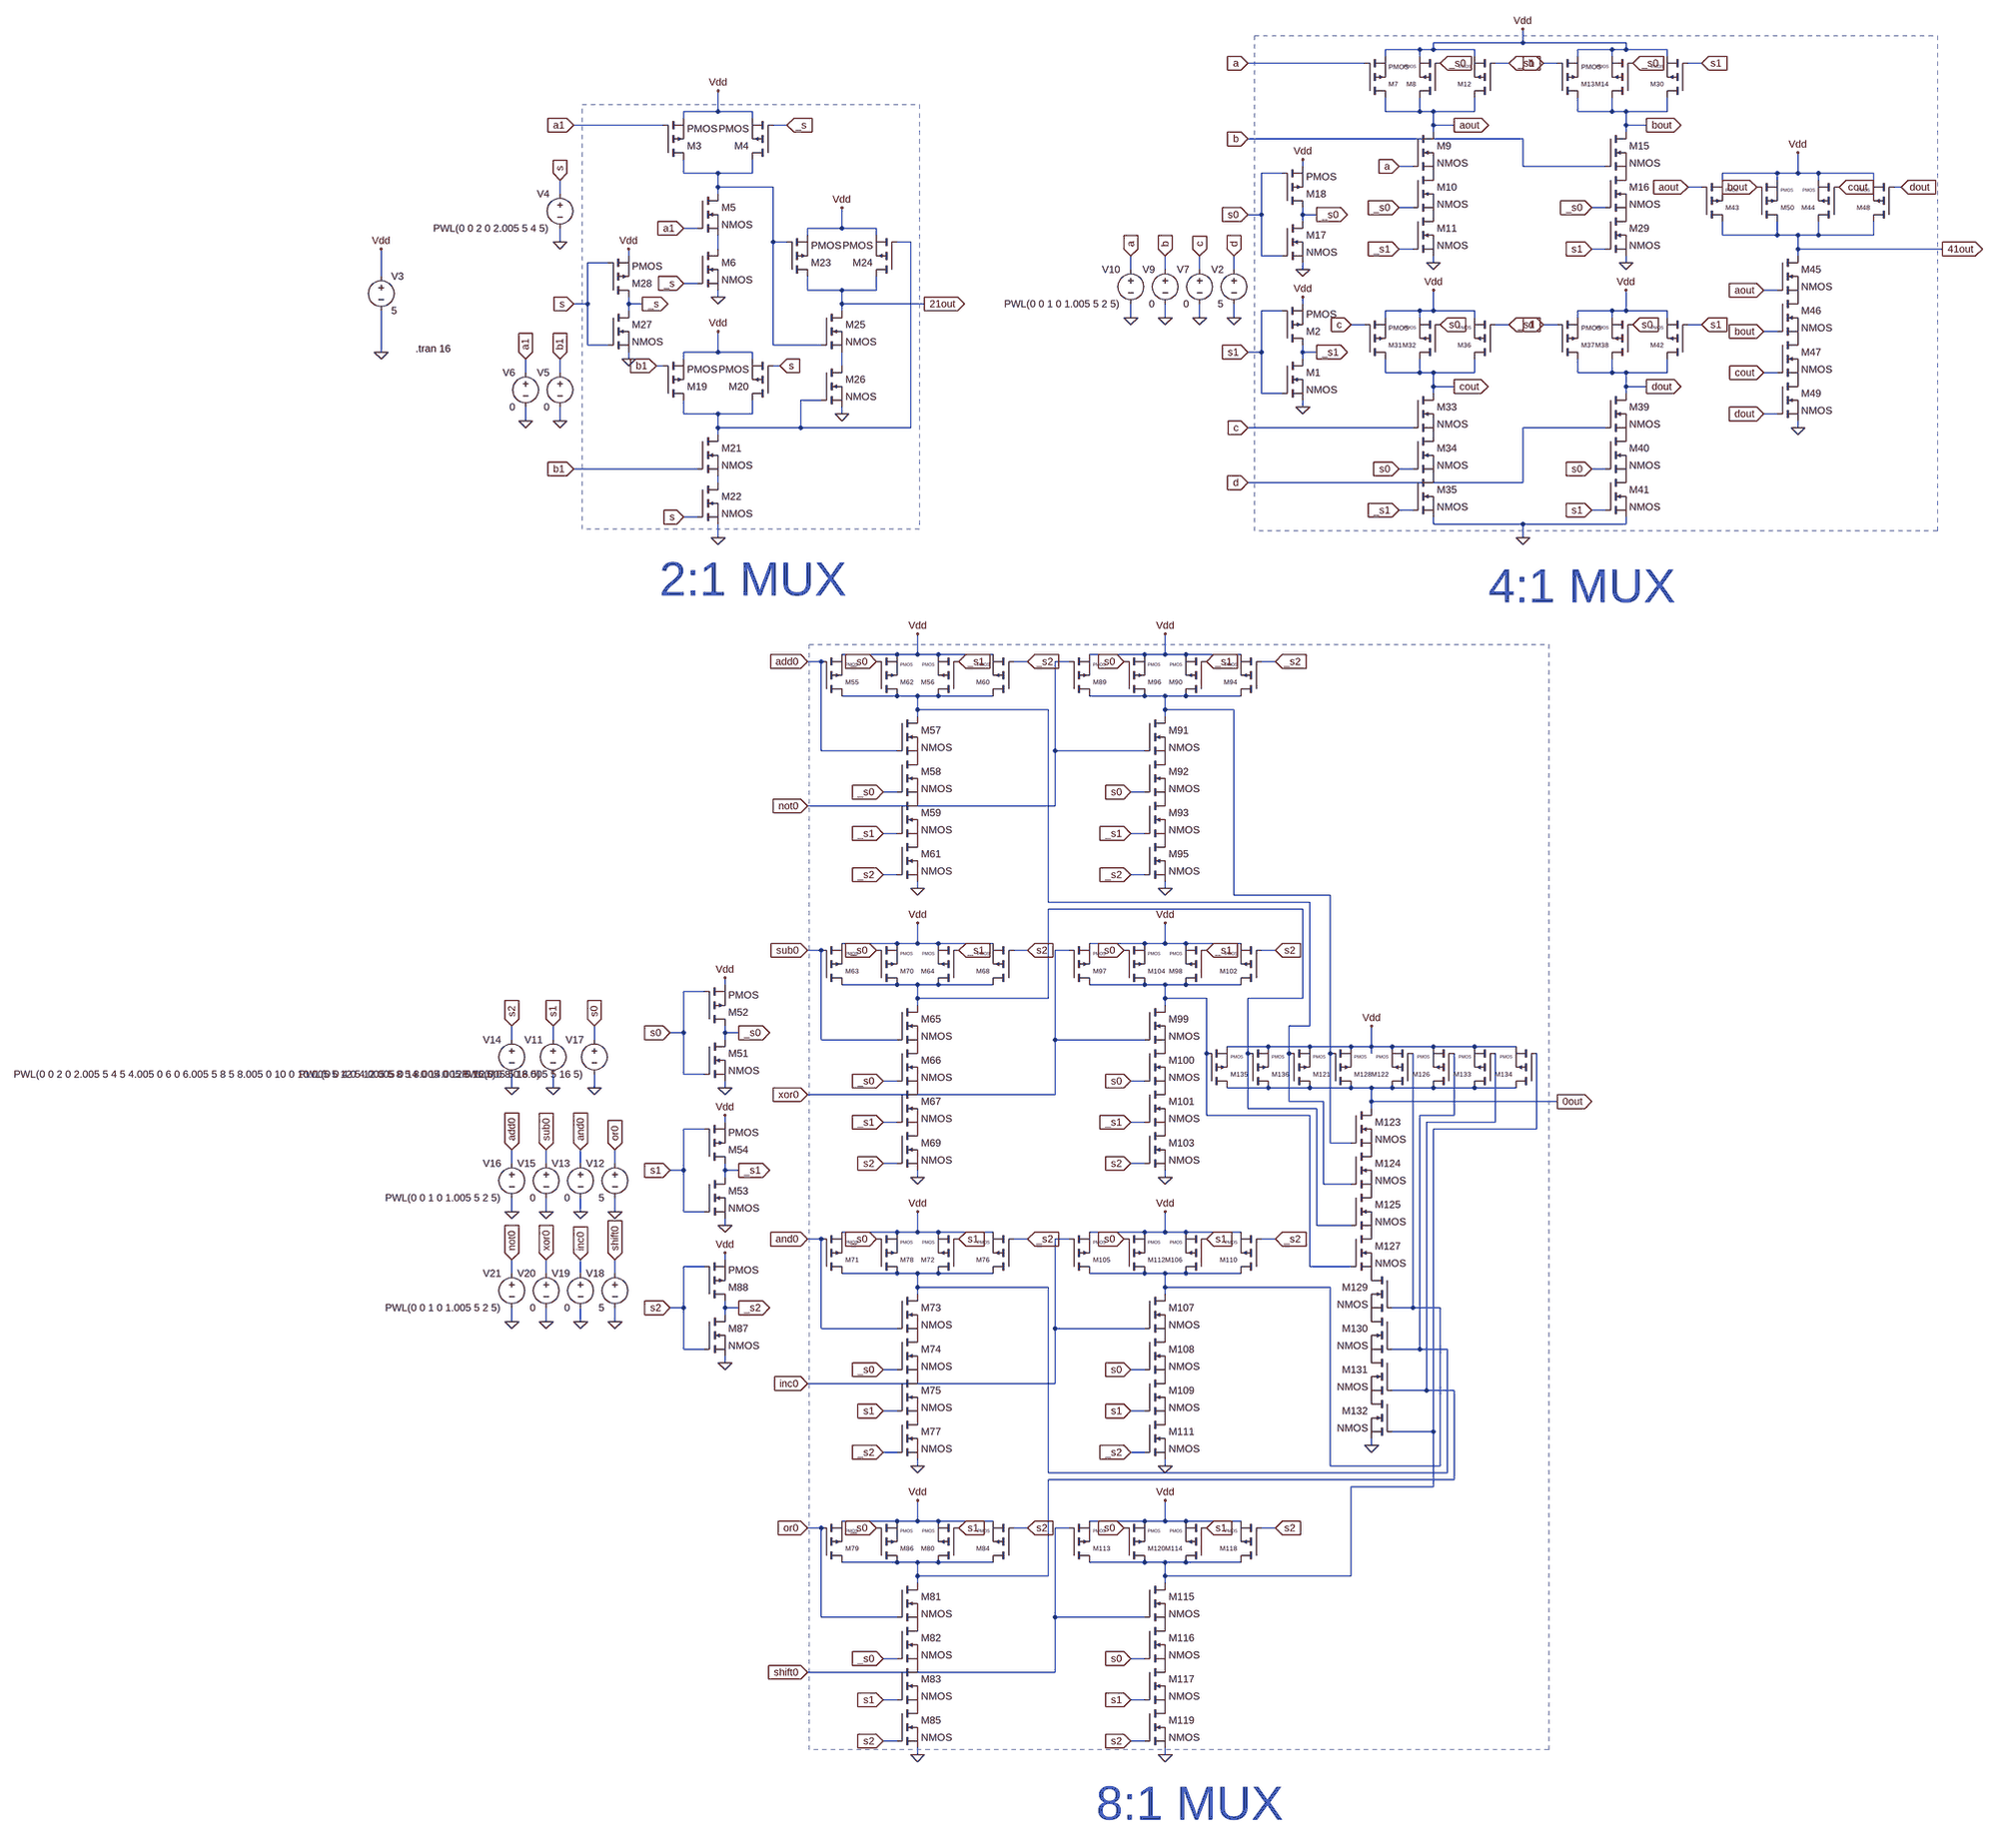
[diagram p0: schematic Digital MUX .asc]
Digital MUX .asc, the LTspice schematic file:
Version 4
SHEET 1 5552 4060
WIRE 1904 -736 1904 -768
WIRE 1904 -736 1696 -736
WIRE 2144 -736 1904 -736
WIRE 1664 -720 1584 -720
WIRE 1696 -720 1696 -736
WIRE 1696 -720 1664 -720
WIRE 1792 -720 1696 -720
WIRE 2112 -720 2032 -720
WIRE 2144 -720 2144 -736
WIRE 2144 -720 2112 -720
WIRE 2240 -720 2144 -720
WIRE 1584 -704 1584 -720
WIRE 1664 -704 1664 -720
WIRE 1792 -704 1792 -720
WIRE 2032 -704 2032 -720
WIRE 2112 -704 2112 -720
WIRE 2240 -704 2240 -720
WIRE 1536 -688 1264 -688
WIRE 1872 -688 1840 -688
WIRE 1984 -688 1952 -688
WIRE 2320 -688 2288 -688
WIRE 32 -576 32 -624
WIRE 32 -576 -48 -576
WIRE 112 -576 32 -576
WIRE 1584 -576 1584 -608
WIRE 1664 -576 1664 -608
WIRE 1664 -576 1584 -576
WIRE 1696 -576 1664 -576
WIRE 1792 -576 1792 -608
WIRE 1792 -576 1696 -576
WIRE 2032 -576 2032 -608
WIRE 2112 -576 2112 -608
WIRE 2112 -576 2032 -576
WIRE 2144 -576 2112 -576
WIRE 2240 -576 2240 -608
WIRE 2240 -576 2144 -576
WIRE -48 -560 -48 -576
WIRE 112 -560 112 -576
WIRE -96 -544 -304 -544
WIRE 192 -544 160 -544
WIRE 1696 -544 1696 -576
WIRE 1744 -544 1696 -544
WIRE 2144 -544 2144 -576
WIRE 2192 -544 2144 -544
WIRE 1696 -528 1696 -544
WIRE 2144 -528 2144 -544
WIRE 1904 -512 1264 -512
WIRE 1392 -448 1392 -464
WIRE 1648 -448 1616 -448
WIRE 1904 -448 1904 -512
WIRE 2096 -448 1904 -448
WIRE -48 -432 -48 -464
WIRE 32 -432 -48 -432
WIRE 112 -432 112 -464
WIRE 112 -432 32 -432
WIRE 1344 -432 1296 -432
WIRE 2496 -432 2368 -432
WIRE 2544 -432 2544 -480
WIRE 2544 -432 2496 -432
WIRE 2592 -432 2544 -432
WIRE 2720 -432 2592 -432
WIRE 2368 -416 2368 -432
WIRE 2496 -416 2496 -432
WIRE 2592 -416 2592 -432
WIRE 2720 -416 2720 -432
WIRE 32 -400 32 -432
WIRE 160 -400 32 -400
WIRE 2320 -400 2288 -400
WIRE 2784 -400 2768 -400
WIRE -336 -384 -336 -416
WIRE 32 -384 32 -400
WIRE 1648 -352 1616 -352
WIRE 2096 -352 2064 -352
WIRE 1296 -336 1296 -432
WIRE 1296 -336 1264 -336
WIRE 1392 -336 1392 -352
WIRE 1424 -336 1392 -336
WIRE 1392 -320 1392 -336
WIRE -16 -304 -48 -304
WIRE 320 -304 320 -352
WIRE 320 -304 240 -304
WIRE 400 -304 320 -304
WIRE 240 -288 240 -304
WIRE 400 -288 400 -304
WIRE 2368 -288 2368 -320
WIRE 2496 -288 2496 -320
WIRE 2496 -288 2368 -288
WIRE 2544 -288 2496 -288
WIRE 2592 -288 2592 -320
WIRE 2592 -288 2544 -288
WIRE 2720 -288 2720 -320
WIRE 2720 -288 2592 -288
WIRE -336 -272 -336 -304
WIRE 160 -272 160 -400
WIRE 192 -272 160 -272
WIRE 480 -272 448 -272
WIRE 32 -256 32 -288
WIRE 1648 -256 1616 -256
WIRE 2096 -256 2064 -256
WIRE 2544 -256 2544 -288
WIRE 2880 -256 2544 -256
WIRE -176 -240 -176 -256
WIRE 1296 -240 1296 -336
WIRE 1344 -240 1296 -240
WIRE 2544 -240 2544 -256
WIRE -224 -224 -272 -224
WIRE 1696 -224 1696 -240
WIRE 2144 -224 2144 -240
WIRE 992 -208 992 -240
WIRE 1072 -208 1072 -240
WIRE 1152 -208 1152 -240
WIRE 1232 -208 1232 -240
WIRE 1392 -208 1392 -224
WIRE -752 -192 -752 -256
WIRE -16 -176 -48 -176
WIRE 240 -160 240 -192
WIRE 320 -160 240 -160
WIRE 400 -160 400 -192
WIRE 400 -160 320 -160
WIRE 2496 -160 2464 -160
WIRE 32 -144 32 -160
WIRE -272 -128 -272 -224
WIRE -272 -128 -304 -128
WIRE -176 -128 -176 -144
WIRE -144 -128 -176 -128
WIRE 320 -128 320 -160
WIRE 512 -128 320 -128
WIRE 1392 -128 1392 -144
WIRE -176 -112 -176 -128
WIRE 320 -112 320 -128
WIRE 1344 -112 1296 -112
WIRE 1664 -112 1584 -112
WIRE 1696 -112 1696 -160
WIRE 1696 -112 1664 -112
WIRE 1792 -112 1696 -112
WIRE 2112 -112 2032 -112
WIRE 2144 -112 2144 -160
WIRE 2144 -112 2112 -112
WIRE 2240 -112 2144 -112
WIRE 992 -96 992 -128
WIRE 1072 -96 1072 -128
WIRE 1152 -96 1152 -128
WIRE 1232 -96 1232 -128
WIRE 1584 -96 1584 -112
WIRE 1664 -96 1664 -112
WIRE 1792 -96 1792 -112
WIRE 2032 -96 2032 -112
WIRE 2112 -96 2112 -112
WIRE 2240 -96 2240 -112
WIRE 1536 -80 1504 -80
WIRE 1872 -80 1840 -80
WIRE 1984 -80 1952 -80
WIRE 2320 -80 2288 -80
WIRE 2496 -64 2464 -64
WIRE -272 -32 -272 -128
WIRE -224 -32 -272 -32
WIRE 160 -32 160 -272
WIRE 272 -32 160 -32
WIRE -752 -16 -752 -112
WIRE 32 -16 32 -64
WIRE 32 -16 -48 -16
WIRE 112 -16 32 -16
WIRE 1296 -16 1296 -112
WIRE 1296 -16 1264 -16
WIRE 1392 -16 1392 -32
WIRE 1424 -16 1392 -16
WIRE -176 0 -176 -16
WIRE -48 0 -48 -16
WIRE 112 0 112 -16
WIRE 1392 0 1392 -16
WIRE -96 16 -112 16
WIRE 176 16 160 16
WIRE 320 16 320 -16
WIRE -416 32 -416 0
WIRE -336 32 -336 0
WIRE 1584 32 1584 0
WIRE 1664 32 1664 0
WIRE 1664 32 1584 32
WIRE 1696 32 1664 32
WIRE 1792 32 1792 0
WIRE 1792 32 1696 32
WIRE 2032 32 2032 0
WIRE 2112 32 2112 0
WIRE 2112 32 2032 32
WIRE 2144 32 2112 32
WIRE 2240 32 2240 0
WIRE 2240 32 2144 32
WIRE 2496 32 2464 32
WIRE 1696 64 1696 32
WIRE 1744 64 1696 64
WIRE 2144 64 2144 32
WIRE 2192 64 2144 64
WIRE 1296 80 1296 -16
WIRE 1344 80 1296 80
WIRE 1696 80 1696 64
WIRE 2144 80 2144 64
WIRE 272 96 224 96
WIRE 1392 112 1392 96
WIRE -48 128 -48 96
WIRE 32 128 -48 128
WIRE 112 128 112 96
WIRE 112 128 32 128
WIRE 320 128 320 112
WIRE 2496 128 2464 128
WIRE -416 144 -416 112
WIRE -336 144 -336 112
WIRE 32 160 32 128
WIRE 224 160 224 96
WIRE 224 160 32 160
WIRE 480 160 480 -272
WIRE 480 160 224 160
WIRE 1648 160 1264 160
WIRE 2096 160 1904 160
WIRE 2544 160 2544 144
WIRE 32 176 32 160
WIRE -16 256 -304 256
WIRE 1648 256 1616 256
WIRE 2096 256 2064 256
WIRE 32 288 32 272
WIRE 1904 288 1904 160
WIRE 1904 288 1264 288
WIRE 1648 352 1616 352
WIRE 2096 352 2064 352
WIRE -16 368 -48 368
WIRE 1696 384 1696 368
WIRE 1904 384 1696 384
WIRE 2144 384 2144 368
WIRE 2144 384 1904 384
WIRE 32 416 32 384
WIRE 1904 416 1904 384
WIRE 448 688 320 688
WIRE 496 688 496 640
WIRE 496 688 448 688
WIRE 544 688 496 688
WIRE 672 688 544 688
WIRE 1024 688 896 688
WIRE 1072 688 1072 640
WIRE 1072 688 1024 688
WIRE 1120 688 1072 688
WIRE 1248 688 1120 688
WIRE 272 704 240 704
WIRE 752 704 720 704
WIRE 848 704 816 704
WIRE 1328 704 1296 704
WIRE 448 784 320 784
WIRE 496 784 448 784
WIRE 544 784 496 784
WIRE 672 784 544 784
WIRE 1024 784 896 784
WIRE 1072 784 1024 784
WIRE 1120 784 1072 784
WIRE 1248 784 1120 784
WIRE 496 816 496 784
WIRE 800 816 496 816
WIRE 1072 816 1072 784
WIRE 1232 816 1072 816
WIRE 496 832 496 816
WIRE 1072 832 1072 816
WIRE 272 912 272 704
WIRE 448 912 272 912
WIRE 816 912 816 704
WIRE 1024 912 816 912
WIRE 448 1008 416 1008
WIRE 1024 1008 992 1008
WIRE 816 1040 816 912
WIRE 816 1040 240 1040
WIRE 448 1104 416 1104
WIRE 1024 1104 992 1104
WIRE 448 1200 416 1200
WIRE 1024 1200 992 1200
WIRE 496 1232 496 1216
WIRE 1072 1232 1072 1216
WIRE 1232 1248 1232 816
WIRE 1456 1248 1232 1248
WIRE 800 1264 800 816
WIRE 1408 1264 800 1264
WIRE 1392 1280 800 1280
WIRE 448 1360 320 1360
WIRE 496 1360 496 1312
WIRE 496 1360 448 1360
WIRE 544 1360 496 1360
WIRE 672 1360 544 1360
WIRE 1024 1360 896 1360
WIRE 1072 1360 1072 1312
WIRE 1072 1360 1024 1360
WIRE 1120 1360 1072 1360
WIRE 1248 1360 1120 1360
WIRE 272 1376 240 1376
WIRE 752 1376 720 1376
WIRE 848 1376 816 1376
WIRE 1328 1376 1296 1376
WIRE 48 1456 48 1440
WIRE 448 1456 320 1456
WIRE 496 1456 448 1456
WIRE 544 1456 496 1456
WIRE 672 1456 544 1456
WIRE 1024 1456 896 1456
WIRE 1072 1456 1024 1456
WIRE 1120 1456 1072 1456
WIRE 1248 1456 1120 1456
WIRE 0 1472 -48 1472
WIRE 496 1488 496 1456
WIRE 800 1488 800 1280
WIRE 800 1488 496 1488
WIRE 1072 1488 1072 1456
WIRE 1168 1488 1072 1488
WIRE 1392 1488 1392 1280
WIRE 1392 1488 1264 1488
WIRE 496 1504 496 1488
WIRE 1072 1504 1072 1488
WIRE 1408 1552 1408 1264
WIRE 1408 1552 1360 1552
WIRE -48 1568 -48 1472
WIRE -48 1568 -80 1568
WIRE 48 1568 48 1552
WIRE 80 1568 48 1568
WIRE -448 1584 -448 1552
WIRE -352 1584 -352 1552
WIRE -256 1584 -256 1552
WIRE 48 1584 48 1568
WIRE 272 1584 272 1376
WIRE 448 1584 272 1584
WIRE 816 1584 816 1376
WIRE 1024 1584 816 1584
WIRE 1312 1600 1216 1600
WIRE 1408 1600 1312 1600
WIRE 1504 1600 1408 1600
WIRE 1552 1600 1552 1552
WIRE 1552 1600 1504 1600
WIRE 1600 1600 1552 1600
WIRE 1696 1600 1600 1600
WIRE 1792 1600 1696 1600
WIRE 1888 1600 1792 1600
WIRE 1168 1616 1168 1488
WIRE 1264 1616 1264 1488
WIRE 1360 1616 1360 1552
WIRE 1456 1616 1456 1248
WIRE 1552 1616 1552 1600
WIRE -48 1664 -48 1568
WIRE 0 1664 -48 1664
WIRE 448 1680 416 1680
WIRE 1024 1680 992 1680
WIRE -448 1696 -448 1664
WIRE -352 1696 -352 1664
WIRE -256 1696 -256 1664
WIRE 48 1696 48 1680
WIRE 1312 1696 1216 1696
WIRE 1408 1696 1312 1696
WIRE 1504 1696 1408 1696
WIRE 1552 1696 1504 1696
WIRE 1600 1696 1552 1696
WIRE 1696 1696 1600 1696
WIRE 1792 1696 1696 1696
WIRE 1888 1696 1792 1696
WIRE 816 1712 816 1584
WIRE 816 1712 240 1712
WIRE 1360 1728 1360 1616
WIRE 1440 1728 1360 1728
WIRE 1552 1728 1552 1696
WIRE 1984 1728 1552 1728
WIRE 1264 1744 1264 1616
WIRE 1424 1744 1264 1744
WIRE 1552 1744 1552 1728
WIRE 1168 1760 1168 1616
WIRE 1408 1760 1168 1760
WIRE 1744 1760 1744 1616
WIRE 1744 1760 1664 1760
WIRE 48 1776 48 1760
WIRE 448 1776 416 1776
WIRE 1024 1776 992 1776
WIRE 1840 1776 1840 1616
WIRE 1840 1776 1680 1776
WIRE 0 1792 -48 1792
WIRE 1936 1792 1936 1616
WIRE 1936 1792 1696 1792
WIRE 1456 1824 1456 1616
WIRE 1504 1824 1456 1824
WIRE -448 1872 -448 1840
WIRE -368 1872 -368 1840
WIRE -288 1872 -288 1840
WIRE -208 1872 -208 1840
WIRE 448 1872 416 1872
WIRE 1024 1872 992 1872
WIRE -48 1888 -48 1792
WIRE -48 1888 -80 1888
WIRE 48 1888 48 1872
WIRE 80 1888 48 1888
WIRE 48 1904 48 1888
WIRE 496 1904 496 1888
WIRE 1072 1904 1072 1888
WIRE 1440 1920 1440 1728
WIRE 1504 1920 1440 1920
WIRE -448 1984 -448 1952
WIRE -368 1984 -368 1952
WIRE -288 1984 -288 1952
WIRE -208 1984 -208 1952
WIRE -48 1984 -48 1888
WIRE 0 1984 -48 1984
WIRE 48 2016 48 2000
WIRE 1424 2016 1424 1744
WIRE 1504 2016 1424 2016
WIRE 448 2032 320 2032
WIRE 496 2032 496 1984
WIRE 496 2032 448 2032
WIRE 544 2032 496 2032
WIRE 672 2032 544 2032
WIRE 1024 2032 896 2032
WIRE 1072 2032 1072 1984
WIRE 1072 2032 1024 2032
WIRE 1120 2032 1072 2032
WIRE 1248 2032 1120 2032
WIRE 272 2048 240 2048
WIRE 752 2048 720 2048
WIRE 848 2048 816 2048
WIRE 1328 2048 1296 2048
WIRE 48 2096 48 2080
WIRE 0 2112 -48 2112
WIRE 1408 2112 1408 1760
WIRE 1504 2112 1408 2112
WIRE -448 2128 -448 2096
WIRE -368 2128 -368 2096
WIRE -288 2128 -288 2096
WIRE -208 2128 -208 2096
WIRE 448 2128 320 2128
WIRE 496 2128 448 2128
WIRE 544 2128 496 2128
WIRE 672 2128 544 2128
WIRE 1024 2128 896 2128
WIRE 1072 2128 1024 2128
WIRE 1120 2128 1072 2128
WIRE 1248 2128 1120 2128
WIRE 496 2160 496 2128
WIRE 800 2160 496 2160
WIRE 1072 2160 1072 2128
WIRE 1456 2160 1072 2160
WIRE 496 2176 496 2160
WIRE 1072 2176 1072 2160
WIRE -48 2208 -48 2112
WIRE -48 2208 -80 2208
WIRE 48 2208 48 2192
WIRE 80 2208 48 2208
WIRE 1648 2208 1648 1616
WIRE 1648 2208 1600 2208
WIRE 1712 2208 1648 2208
WIRE 48 2224 48 2208
WIRE -448 2240 -448 2208
WIRE -368 2240 -368 2208
WIRE -288 2240 -288 2208
WIRE -208 2240 -208 2208
WIRE 272 2256 272 2048
WIRE 448 2256 272 2256
WIRE 816 2256 816 2048
WIRE 1024 2256 816 2256
WIRE -48 2304 -48 2208
WIRE 0 2304 -48 2304
WIRE 1664 2304 1664 1760
WIRE 1664 2304 1600 2304
WIRE 1728 2304 1664 2304
WIRE 48 2336 48 2320
WIRE 448 2352 416 2352
WIRE 1024 2352 992 2352
WIRE 816 2384 816 2256
WIRE 816 2384 240 2384
WIRE 1680 2400 1680 1776
WIRE 1680 2400 1600 2400
WIRE 1744 2400 1680 2400
WIRE 448 2448 416 2448
WIRE 1024 2448 992 2448
WIRE 1696 2496 1696 1792
WIRE 1696 2496 1600 2496
WIRE 1552 2528 1552 2512
WIRE 448 2544 416 2544
WIRE 1024 2544 992 2544
WIRE 496 2576 496 2560
WIRE 1072 2576 1072 2560
WIRE 1456 2576 1456 2160
WIRE 1712 2576 1712 2208
WIRE 1712 2576 1456 2576
WIRE 800 2592 800 2160
WIRE 1728 2592 1728 2304
WIRE 1728 2592 800 2592
WIRE 1744 2608 1744 2400
WIRE 1744 2608 800 2608
WIRE 1696 2624 1696 2496
WIRE 1696 2624 1504 2624
WIRE 448 2704 320 2704
WIRE 496 2704 496 2656
WIRE 496 2704 448 2704
WIRE 544 2704 496 2704
WIRE 672 2704 544 2704
WIRE 1024 2704 896 2704
WIRE 1072 2704 1072 2656
WIRE 1072 2704 1024 2704
WIRE 1120 2704 1072 2704
WIRE 1248 2704 1120 2704
WIRE 272 2720 240 2720
WIRE 752 2720 720 2720
WIRE 848 2720 816 2720
WIRE 1328 2720 1296 2720
WIRE 448 2800 320 2800
WIRE 496 2800 448 2800
WIRE 544 2800 496 2800
WIRE 672 2800 544 2800
WIRE 1024 2800 896 2800
WIRE 1072 2800 1024 2800
WIRE 1120 2800 1072 2800
WIRE 1248 2800 1120 2800
WIRE 496 2832 496 2800
WIRE 800 2832 800 2608
WIRE 800 2832 496 2832
WIRE 1072 2832 1072 2800
WIRE 1504 2832 1504 2624
WIRE 1504 2832 1072 2832
WIRE 496 2848 496 2832
WIRE 1072 2848 1072 2832
WIRE 272 2928 272 2720
WIRE 448 2928 272 2928
WIRE 816 2928 816 2720
WIRE 1024 2928 816 2928
WIRE 448 3024 416 3024
WIRE 1024 3024 992 3024
WIRE 816 3056 816 2928
WIRE 816 3056 240 3056
WIRE 448 3120 416 3120
WIRE 1024 3120 992 3120
WIRE 448 3216 416 3216
WIRE 1024 3216 992 3216
WIRE 496 3248 496 3232
WIRE 1072 3248 1072 3232
FLAG -752 -16 0
FLAG -752 -256 Vdd
FLAG -336 -272 0
FLAG -336 -416 s
IOPIN -336 -416 In
FLAG -336 144 0
FLAG -336 0 b1
IOPIN -336 0 In
FLAG -416 144 0
FLAG -416 0 a1
IOPIN -416 0 In
FLAG 32 -624 Vdd
FLAG 32 -144 0
FLAG -48 -176 _s
IOPIN -48 -176 In
FLAG -48 -304 a1
IOPIN -48 -304 In
FLAG -304 -544 a1
IOPIN -304 -544 In
FLAG 192 -544 _s
IOPIN 192 -544 In
FLAG 32 -64 Vdd
FLAG 32 416 0
FLAG -48 368 s
IOPIN -48 368 In
FLAG -304 256 b1
IOPIN -304 256 In
FLAG -112 16 b1
IOPIN -112 16 In
FLAG 176 16 s
IOPIN 176 16 In
FLAG 320 -352 Vdd
FLAG 320 128 0
FLAG 512 -128 21out
IOPIN 512 -128 Out
FLAG -176 0 0
FLAG -176 -256 Vdd
FLAG -144 -128 _s
IOPIN -144 -128 Out
FLAG -304 -128 s
IOPIN -304 -128 In
FLAG 1232 -96 0
FLAG 1232 -240 d
IOPIN 1232 -240 In
FLAG 1152 -96 0
FLAG 1152 -240 c
IOPIN 1152 -240 In
FLAG 1392 -208 0
FLAG 1392 -464 Vdd
FLAG 1424 -336 _s0
IOPIN 1424 -336 Out
FLAG 1264 -336 s0
IOPIN 1264 -336 In
FLAG 1392 112 0
FLAG 1392 -144 Vdd
FLAG 1424 -16 _s1
IOPIN 1424 -16 Out
FLAG 1264 -16 s1
IOPIN 1264 -16 In
FLAG 1904 -768 Vdd
FLAG 1264 -688 a
IOPIN 1264 -688 In
FLAG 1712 -688 _s0
IOPIN 1712 -688 In
FLAG 1744 -544 aout
IOPIN 1744 -544 Out
FLAG 1616 -352 _s0
IOPIN 1616 -352 In
FLAG 1616 -448 a
IOPIN 1616 -448 In
FLAG 1696 -224 0
FLAG 1616 -256 _s1
IOPIN 1616 -256 In
FLAG 1872 -688 _s1
IOPIN 1872 -688 In
FLAG 1952 -688 b
IOPIN 1952 -688 In
FLAG 2160 -688 _s0
IOPIN 2160 -688 In
FLAG 2192 -544 bout
IOPIN 2192 -544 Out
FLAG 2064 -352 _s0
IOPIN 2064 -352 In
FLAG 1264 -512 b
IOPIN 1264 -512 In
FLAG 2144 -224 0
FLAG 2064 -256 s1
IOPIN 2064 -256 In
FLAG 2320 -688 s1
IOPIN 2320 -688 In
FLAG 1696 -160 Vdd
FLAG 1504 -80 c
IOPIN 1504 -80 In
FLAG 1712 -80 s0
IOPIN 1712 -80 In
FLAG 1744 64 cout
IOPIN 1744 64 Out
FLAG 1616 256 s0
IOPIN 1616 256 In
FLAG 1264 160 c
IOPIN 1264 160 In
FLAG 1904 416 0
FLAG 1616 352 _s1
IOPIN 1616 352 In
FLAG 1872 -80 _s1
IOPIN 1872 -80 In
FLAG 2144 -160 Vdd
FLAG 1952 -80 d
IOPIN 1952 -80 In
FLAG 2160 -80 s0
IOPIN 2160 -80 In
FLAG 2192 64 dout
IOPIN 2192 64 Out
FLAG 2064 256 s0
IOPIN 2064 256 In
FLAG 1264 288 d
IOPIN 1264 288 In
FLAG 2064 352 s1
IOPIN 2064 352 In
FLAG 2320 -80 s1
IOPIN 2320 -80 In
FLAG 1072 -96 0
FLAG 1072 -240 b
IOPIN 1072 -240 In
FLAG 992 -96 0
FLAG 992 -240 a
IOPIN 992 -240 In
FLAG 2544 -480 Vdd
FLAG 2288 -400 aout
IOPIN 2288 -400 In
FLAG 2640 -400 cout
IOPIN 2640 -400 In
FLAG 2880 -256 41out
IOPIN 2880 -256 Out
FLAG 2464 -64 bout
IOPIN 2464 -64 In
FLAG 2464 -160 aout
IOPIN 2464 -160 In
FLAG 2464 32 cout
IOPIN 2464 32 In
FLAG 2784 -400 dout
IOPIN 2784 -400 In
FLAG 2544 160 0
FLAG 2464 128 dout
IOPIN 2464 128 In
FLAG 2448 -400 bout
IOPIN 2448 -400 In
FLAG -352 1696 0
FLAG -352 1552 s1
IOPIN -352 1552 In
FLAG -208 1984 0
FLAG -208 1840 or0
IOPIN -208 1840 In
FLAG -288 1984 0
FLAG -288 1840 and0
IOPIN -288 1840 In
FLAG 48 1696 0
FLAG 48 1440 Vdd
FLAG 80 1568 _s0
IOPIN 80 1568 Out
FLAG -80 1568 s0
IOPIN -80 1568 In
FLAG -448 1696 0
FLAG -448 1552 s2
IOPIN -448 1552 In
FLAG 48 2016 0
FLAG 48 1760 Vdd
FLAG 80 1888 _s1
IOPIN 80 1888 Out
FLAG -80 1888 s1
IOPIN -80 1888 In
FLAG -368 1984 0
FLAG -368 1840 sub0
IOPIN -368 1840 In
FLAG -448 1984 0
FLAG -448 1840 add0
IOPIN -448 1840 In
FLAG -256 1696 0
FLAG -256 1552 s0
IOPIN -256 1552 In
FLAG -208 2240 0
FLAG -208 2096 shift0
IOPIN -208 2096 In
FLAG -288 2240 0
FLAG -288 2096 inc0
IOPIN -288 2096 In
FLAG -368 2240 0
FLAG -368 2096 xor0
IOPIN -368 2096 In
FLAG -448 2240 0
FLAG -448 2096 not0
IOPIN -448 2096 In
FLAG 48 2336 0
FLAG 48 2080 Vdd
FLAG 80 2208 _s2
IOPIN 80 2208 Out
FLAG -80 2208 s2
IOPIN -80 2208 In
FLAG 496 640 Vdd
FLAG 240 704 add0
IOPIN 240 704 In
FLAG 592 704 _s1
IOPIN 592 704 In
FLAG 416 1008 _s0
IOPIN 416 1008 In
FLAG 416 1104 _s1
IOPIN 416 1104 In
FLAG 752 704 _s2
IOPIN 752 704 In
FLAG 496 1232 0
FLAG 416 1200 _s2
IOPIN 416 1200 In
FLAG 400 704 _s0
IOPIN 400 704 In
FLAG 496 1312 Vdd
FLAG 240 1376 sub0
IOPIN 240 1376 In
FLAG 592 1376 _s1
IOPIN 592 1376 In
FLAG 416 1680 _s0
IOPIN 416 1680 In
FLAG 416 1776 _s1
IOPIN 416 1776 In
FLAG 752 1376 s2
IOPIN 752 1376 In
FLAG 496 1904 0
FLAG 416 1872 s2
IOPIN 416 1872 In
FLAG 400 1376 _s0
IOPIN 400 1376 In
FLAG 496 1984 Vdd
FLAG 240 2048 and0
IOPIN 240 2048 In
FLAG 592 2048 s1
IOPIN 592 2048 In
FLAG 416 2352 _s0
IOPIN 416 2352 In
FLAG 416 2448 s1
IOPIN 416 2448 In
FLAG 752 2048 _s2
IOPIN 752 2048 In
FLAG 496 2576 0
FLAG 416 2544 _s2
IOPIN 416 2544 In
FLAG 400 2048 _s0
IOPIN 400 2048 In
FLAG 496 2656 Vdd
FLAG 240 2720 or0
IOPIN 240 2720 In
FLAG 592 2720 s1
IOPIN 592 2720 In
FLAG 416 3024 _s0
IOPIN 416 3024 In
FLAG 416 3120 s1
IOPIN 416 3120 In
FLAG 752 2720 s2
IOPIN 752 2720 In
FLAG 496 3248 0
FLAG 416 3216 s2
IOPIN 416 3216 In
FLAG 400 2720 _s0
IOPIN 400 2720 In
FLAG 1072 640 Vdd
FLAG 240 1040 not0
IOPIN 240 1040 In
FLAG 1168 704 _s1
IOPIN 1168 704 In
FLAG 992 1008 s0
IOPIN 992 1008 In
FLAG 992 1104 _s1
IOPIN 992 1104 In
FLAG 1328 704 _s2
IOPIN 1328 704 In
FLAG 1072 1232 0
FLAG 992 1200 _s2
IOPIN 992 1200 In
FLAG 976 704 s0
IOPIN 976 704 In
FLAG 1072 1312 Vdd
FLAG 240 1712 xor0
IOPIN 240 1712 In
FLAG 1168 1376 _s1
IOPIN 1168 1376 In
FLAG 992 1680 s0
IOPIN 992 1680 In
FLAG 992 1776 _s1
IOPIN 992 1776 In
FLAG 1328 1376 s2
IOPIN 1328 1376 In
FLAG 1072 1904 0
FLAG 992 1872 s2
IOPIN 992 1872 In
FLAG 976 1376 s0
IOPIN 976 1376 In
FLAG 1072 1984 Vdd
FLAG 240 2384 inc0
IOPIN 240 2384 In
FLAG 1168 2048 s1
IOPIN 1168 2048 In
FLAG 992 2352 s0
IOPIN 992 2352 In
FLAG 992 2448 s1
IOPIN 992 2448 In
FLAG 1328 2048 _s2
IOPIN 1328 2048 In
FLAG 1072 2576 0
FLAG 992 2544 _s2
IOPIN 992 2544 In
FLAG 976 2048 s0
IOPIN 976 2048 In
FLAG 1072 2656 Vdd
FLAG 240 3056 shift0
IOPIN 240 3056 In
FLAG 1168 2720 s1
IOPIN 1168 2720 In
FLAG 992 3024 s0
IOPIN 992 3024 In
FLAG 992 3120 s1
IOPIN 992 3120 In
FLAG 1328 2720 s2
IOPIN 1328 2720 In
FLAG 1072 3248 0
FLAG 992 3216 s2
IOPIN 992 3216 In
FLAG 976 2720 s0
IOPIN 976 2720 In
FLAG 1552 1552 Vdd
FLAG 1984 1728 0out
IOPIN 1984 1728 Out
FLAG 1552 2528 0
SYMBOL voltage -752 -208 R0
SYMATTR InstName V3
SYMATTR Value 5
SYMBOL voltage -336 -400 M0
SYMATTR InstName V4
SYMATTR Value PWL(0 0 2 0 2.005 5 4 5)
SYMBOL voltage -336 16 M0
SYMATTR InstName V5
SYMATTR Value 0
SYMBOL voltage -416 16 M0
SYMATTR InstName V6
SYMATTR Value 0
SYMBOL pmos -96 -464 M180
SYMATTR InstName M3
SYMBOL pmos 160 -464 R180
SYMATTR InstName M4
SYMBOL nmos -16 -384 R0
SYMATTR InstName M5
SYMBOL nmos -16 -256 R0
SYMATTR InstName M6
SYMBOL pmos -96 96 M180
SYMATTR InstName M19
SYMBOL pmos 160 96 R180
SYMATTR InstName M20
SYMBOL nmos -16 176 R0
SYMATTR InstName M21
SYMBOL nmos -16 288 R0
SYMATTR InstName M22
SYMBOL pmos 192 -192 M180
SYMATTR InstName M23
SYMBOL pmos 448 -192 R180
SYMATTR InstName M24
SYMBOL nmos 272 -112 R0
SYMATTR InstName M25
SYMBOL nmos 272 16 R0
SYMATTR InstName M26
SYMBOL nmos -224 -112 R0
SYMATTR InstName M27
SYMBOL pmos -224 -144 M180
SYMATTR InstName M28
SYMBOL voltage 1232 -224 M0
SYMATTR InstName V2
SYMATTR Value 5
SYMBOL voltage 1152 -224 M0
SYMATTR InstName V7
SYMATTR Value 0
SYMBOL nmos 1344 -320 R0
SYMATTR InstName M17
SYMBOL pmos 1344 -352 M180
SYMATTR InstName M18
SYMBOL nmos 1344 0 R0
SYMATTR InstName M1
SYMBOL pmos 1344 -32 M180
SYMATTR InstName M2
SYMBOL pmos 1536 -608 M180
WINDOW 0 56 32 Left 1
WINDOW 3 56 72 Left 1
SYMATTR InstName M7
SYMBOL pmos 1712 -608 R180
WINDOW 0 56 32 Left 1
WINDOW 3 56 72 Left 0
SYMATTR InstName M8
SYMBOL nmos 1648 -528 R0
SYMATTR InstName M9
SYMBOL nmos 1648 -432 R0
SYMATTR InstName M10
SYMBOL nmos 1648 -336 R0
SYMATTR InstName M11
SYMBOL pmos 1840 -608 R180
WINDOW 0 56 32 Left 1
WINDOW 3 56 72 Left 0
SYMATTR InstName M12
SYMBOL pmos 1984 -608 M180
WINDOW 0 56 32 Left 1
WINDOW 3 56 72 Left 1
SYMATTR InstName M13
SYMBOL pmos 2160 -608 R180
WINDOW 0 56 32 Left 1
WINDOW 3 56 72 Left 0
SYMATTR InstName M14
SYMBOL nmos 2096 -528 R0
SYMATTR InstName M15
SYMBOL nmos 2096 -432 R0
SYMATTR InstName M16
SYMBOL nmos 2096 -336 R0
SYMATTR InstName M29
SYMBOL pmos 2288 -608 R180
WINDOW 0 56 32 Left 1
WINDOW 3 56 72 Left 0
SYMATTR InstName M30
SYMBOL pmos 1536 0 M180
WINDOW 0 56 32 Left 1
WINDOW 3 56 72 Left 1
SYMATTR InstName M31
SYMBOL pmos 1712 0 R180
WINDOW 0 56 32 Left 1
WINDOW 3 56 72 Left 0
SYMATTR InstName M32
SYMBOL nmos 1648 80 R0
SYMATTR InstName M33
SYMBOL nmos 1648 176 R0
SYMATTR InstName M34
SYMBOL nmos 1648 272 R0
SYMATTR InstName M35
SYMBOL pmos 1840 0 R180
WINDOW 0 56 32 Left 1
WINDOW 3 56 72 Left 0
SYMATTR InstName M36
SYMBOL pmos 1984 0 M180
WINDOW 0 56 32 Left 1
WINDOW 3 56 72 Left 1
SYMATTR InstName M37
SYMBOL pmos 2160 0 R180
WINDOW 0 56 32 Left 1
WINDOW 3 56 72 Left 0
SYMATTR InstName M38
SYMBOL nmos 2096 80 R0
SYMATTR InstName M39
SYMBOL nmos 2096 176 R0
SYMATTR InstName M40
SYMBOL nmos 2096 272 R0
SYMATTR InstName M41
SYMBOL pmos 2288 0 R180
WINDOW 0 56 32 Left 1
WINDOW 3 56 72 Left 0
SYMATTR InstName M42
SYMBOL voltage 1072 -224 M0
SYMATTR InstName V9
SYMATTR Value 0
SYMBOL voltage 992 -224 M0
SYMATTR InstName V10
SYMATTR Value PWL(0 0 1 0 1.005 5 2 5)
SYMBOL pmos 2320 -320 M180
WINDOW 0 56 32 Left 1
WINDOW 3 56 72 Left 0
SYMATTR InstName M43
SYMBOL pmos 2640 -320 R180
WINDOW 0 56 32 Left 1
WINDOW 3 56 72 Left 0
SYMATTR InstName M44
SYMBOL nmos 2496 -240 R0
SYMATTR InstName M45
SYMBOL nmos 2496 -144 R0
SYMATTR InstName M46
SYMBOL nmos 2496 -48 R0
SYMATTR InstName M47
SYMBOL pmos 2768 -320 R180
WINDOW 0 56 32 Left 1
WINDOW 3 56 72 Left 0
SYMATTR InstName M48
SYMBOL nmos 2496 48 R0
SYMATTR InstName M49
SYMBOL pmos 2448 -320 M180
WINDOW 0 56 32 Left 1
WINDOW 3 56 72 Left 0
SYMATTR InstName M50
SYMBOL voltage -352 1568 M0
SYMATTR InstName V11
SYMATTR Value PWL(0 0 4 0 4.005 5 8 5 8.005 0 12 0 12.005 5 16 5)
SYMBOL voltage -208 1856 M0
SYMATTR InstName V12
SYMATTR Value 5
SYMBOL voltage -288 1856 M0
SYMATTR InstName V13
SYMATTR Value 0
SYMBOL nmos 0 1584 R0
SYMATTR InstName M51
SYMBOL pmos 0 1552 M180
SYMATTR InstName M52
SYMBOL voltage -448 1568 M0
SYMATTR InstName V14
SYMATTR Value PWL(0 0 2 0 2.005 5 4 5 4.005 0 6 0 6.005 5 8 5 8.005 0 10 0 10.005 5 12 5 12.005 0 14 0 14.005 5 16 5)
SYMBOL nmos 0 1904 R0
SYMATTR InstName M53
SYMBOL pmos 0 1872 M180
SYMATTR InstName M54
SYMBOL voltage -368 1856 M0
SYMATTR InstName V15
SYMATTR Value 0
SYMBOL voltage -448 1856 M0
SYMATTR InstName V16
SYMATTR Value PWL(0 0 1 0 1.005 5 2 5)
SYMBOL voltage -256 1568 M0
SYMATTR InstName V17
SYMATTR Value PWL(0 0 8 0 8.005 5 16 5)
SYMBOL voltage -208 2112 M0
SYMATTR InstName V18
SYMATTR Value 5
SYMBOL voltage -288 2112 M0
SYMATTR InstName V19
SYMATTR Value 0
SYMBOL voltage -368 2112 M0
SYMATTR InstName V20
SYMATTR Value 0
SYMBOL voltage -448 2112 M0
SYMATTR InstName V21
SYMATTR Value PWL(0 0 1 0 1.005 5 2 5)
SYMBOL nmos 0 2224 R0
SYMATTR InstName M87
SYMBOL pmos 0 2192 M180
SYMATTR InstName M88
SYMBOL pmos 272 784 M180
WINDOW 0 56 32 Left 1
WINDOW 3 56 72 Left 0
SYMATTR InstName M55
SYMBOL pmos 592 784 R180
WINDOW 0 56 32 Left 1
WINDOW 3 56 72 Left 0
SYMATTR InstName M56
SYMBOL nmos 448 832 R0
SYMATTR InstName M57
SYMBOL nmos 448 928 R0
SYMATTR InstName M58
SYMBOL nmos 448 1024 R0
SYMATTR InstName M59
SYMBOL pmos 720 784 R180
WINDOW 0 56 32 Left 1
WINDOW 3 56 72 Left 0
SYMATTR InstName M60
SYMBOL nmos 448 1120 R0
SYMATTR InstName M61
SYMBOL pmos 400 784 M180
WINDOW 0 56 32 Left 1
WINDOW 3 56 72 Left 0
SYMATTR InstName M62
SYMBOL pmos 272 1456 M180
WINDOW 0 56 32 Left 1
WINDOW 3 56 72 Left 0
SYMATTR InstName M63
SYMBOL pmos 592 1456 R180
WINDOW 0 56 32 Left 1
WINDOW 3 56 72 Left 0
SYMATTR InstName M64
SYMBOL nmos 448 1504 R0
SYMATTR InstName M65
SYMBOL nmos 448 1600 R0
SYMATTR InstName M66
SYMBOL nmos 448 1696 R0
SYMATTR InstName M67
SYMBOL pmos 720 1456 R180
WINDOW 0 56 32 Left 1
WINDOW 3 56 72 Left 0
SYMATTR InstName M68
SYMBOL nmos 448 1792 R0
SYMATTR InstName M69
SYMBOL pmos 400 1456 M180
WINDOW 0 56 32 Left 1
WINDOW 3 56 72 Left 0
SYMATTR InstName M70
SYMBOL pmos 272 2128 M180
WINDOW 0 56 32 Left 1
WINDOW 3 56 72 Left 0
SYMATTR InstName M71
SYMBOL pmos 592 2128 R180
WINDOW 0 56 32 Left 1
WINDOW 3 56 72 Left 0
SYMATTR InstName M72
SYMBOL nmos 448 2176 R0
SYMATTR InstName M73
SYMBOL nmos 448 2272 R0
SYMATTR InstName M74
SYMBOL nmos 448 2368 R0
SYMATTR InstName M75
SYMBOL pmos 720 2128 R180
WINDOW 0 56 32 Left 1
WINDOW 3 56 72 Left 0
SYMATTR InstName M76
SYMBOL nmos 448 2464 R0
SYMATTR InstName M77
SYMBOL pmos 400 2128 M180
WINDOW 0 56 32 Left 1
WINDOW 3 56 72 Left 0
SYMATTR InstName M78
SYMBOL pmos 272 2800 M180
WINDOW 0 56 32 Left 1
WINDOW 3 56 72 Left 0
SYMATTR InstName M79
SYMBOL pmos 592 2800 R180
WINDOW 0 56 32 Left 1
WINDOW 3 56 72 Left 0
SYMATTR InstName M80
SYMBOL nmos 448 2848 R0
SYMATTR InstName M81
SYMBOL nmos 448 2944 R0
SYMATTR InstName M82
SYMBOL nmos 448 3040 R0
SYMATTR InstName M83
SYMBOL pmos 720 2800 R180
WINDOW 0 56 32 Left 1
WINDOW 3 56 72 Left 0
SYMATTR InstName M84
SYMBOL nmos 448 3136 R0
SYMATTR InstName M85
SYMBOL pmos 400 2800 M180
WINDOW 0 56 32 Left 1
WINDOW 3 56 72 Left 0
SYMATTR InstName M86
SYMBOL pmos 848 784 M180
WINDOW 0 56 32 Left 1
WINDOW 3 56 72 Left 0
SYMATTR InstName M89
SYMBOL pmos 1168 784 R180
WINDOW 0 56 32 Left 1
WINDOW 3 56 72 Left 0
SYMATTR InstName M90
SYMBOL nmos 1024 832 R0
SYMATTR InstName M91
SYMBOL nmos 1024 928 R0
SYMATTR InstName M92
SYMBOL nmos 1024 1024 R0
SYMATTR InstName M93
SYMBOL pmos 1296 784 R180
WINDOW 0 56 32 Left 1
WINDOW 3 56 72 Left 0
SYMATTR InstName M94
SYMBOL nmos 1024 1120 R0
SYMATTR InstName M95
SYMBOL pmos 976 784 M180
WINDOW 0 56 32 Left 1
WINDOW 3 56 72 Left 0
SYMATTR InstName M96
SYMBOL pmos 848 1456 M180
WINDOW 0 56 32 Left 1
WINDOW 3 56 72 Left 0
SYMATTR InstName M97
SYMBOL pmos 1168 1456 R180
WINDOW 0 56 32 Left 1
WINDOW 3 56 72 Left 0
SYMATTR InstName M98
SYMBOL nmos 1024 1504 R0
SYMATTR InstName M99
SYMBOL nmos 1024 1600 R0
SYMATTR InstName M100
SYMBOL nmos 1024 1696 R0
SYMATTR InstName M101
SYMBOL pmos 1296 1456 R180
WINDOW 0 56 32 Left 1
WINDOW 3 56 72 Left 0
SYMATTR InstName M102
SYMBOL nmos 1024 1792 R0
SYMATTR InstName M103
SYMBOL pmos 976 1456 M180
WINDOW 0 56 32 Left 1
WINDOW 3 56 72 Left 0
SYMATTR InstName M104
SYMBOL pmos 848 2128 M180
WINDOW 0 56 32 Left 1
WINDOW 3 56 72 Left 0
SYMATTR InstName M105
SYMBOL pmos 1168 2128 R180
WINDOW 0 56 32 Left 1
WINDOW 3 56 72 Left 0
SYMATTR InstName M106
SYMBOL nmos 1024 2176 R0
SYMATTR InstName M107
SYMBOL nmos 1024 2272 R0
SYMATTR InstName M108
SYMBOL nmos 1024 2368 R0
SYMATTR InstName M109
SYMBOL pmos 1296 2128 R180
WINDOW 0 56 32 Left 1
WINDOW 3 56 72 Left 0
SYMATTR InstName M110
SYMBOL nmos 1024 2464 R0
SYMATTR InstName M111
SYMBOL pmos 976 2128 M180
WINDOW 0 56 32 Left 1
WINDOW 3 56 72 Left 0
SYMATTR InstName M112
SYMBOL pmos 848 2800 M180
WINDOW 0 56 32 Left 1
WINDOW 3 56 72 Left 0
SYMATTR InstName M113
SYMBOL pmos 1168 2800 R180
WINDOW 0 56 32 Left 1
WINDOW 3 56 72 Left 0
SYMATTR InstName M114
SYMBOL nmos 1024 2848 R0
SYMATTR InstName M115
SYMBOL nmos 1024 2944 R0
SYMATTR InstName M116
SYMBOL nmos 1024 3040 R0
SYMATTR InstName M117
SYMBOL pmos 1296 2800 R180
WINDOW 0 56 32 Left 1
WINDOW 3 56 72 Left 0
SYMATTR InstName M118
SYMBOL nmos 1024 3136 R0
SYMATTR InstName M119
SYMBOL pmos 976 2800 M180
WINDOW 0 56 32 Left 1
WINDOW 3 56 72 Left 0
SYMATTR InstName M120
SYMBOL pmos 1360 1696 M180
WINDOW 0 56 32 Left 1
WINDOW 3 56 72 Left 0
SYMATTR InstName M121
SYMBOL pmos 1648 1696 R180
WINDOW 0 56 32 Left 1
WINDOW 3 56 72 Left 0
SYMATTR InstName M122
SYMBOL nmos 1504 1744 R0
SYMATTR InstName M123
SYMBOL nmos 1504 1840 R0
SYMATTR InstName M124
SYMBOL nmos 1504 1936 R0
SYMATTR InstName M125
SYMBOL pmos 1744 1696 R180
WINDOW 0 56 32 Left 1
WINDOW 3 56 72 Left 0
SYMATTR InstName M126
SYMBOL nmos 1504 2032 R0
SYMATTR InstName M127
SYMBOL pmos 1456 1696 M180
WINDOW 0 56 32 Left 1
WINDOW 3 56 72 Left 0
SYMATTR InstName M128
SYMBOL nmos 1600 2128 M0
SYMATTR InstName M129
SYMBOL nmos 1600 2224 M0
SYMATTR InstName M130
SYMBOL nmos 1600 2320 M0
SYMATTR InstName M131
SYMBOL nmos 1600 2416 M0
SYMATTR InstName M132
SYMBOL pmos 1840 1696 R180
WINDOW 0 56 32 Left 1
WINDOW 3 56 72 Left 0
SYMATTR InstName M133
SYMBOL pmos 1936 1696 R180
WINDOW 0 56 32 Left 1
WINDOW 3 56 72 Left 0
SYMATTR InstName M134
SYMBOL pmos 1168 1696 M180
WINDOW 0 56 32 Left 1
WINDOW 3 56 72 Left 0
SYMATTR InstName M135
SYMBOL pmos 1264 1696 M180
WINDOW 0 56 32 Left 1
WINDOW 3 56 72 Left 0
SYMATTR InstName M136
TEXT -672 -24 Left 2 !.tran 16
TEXT -104 512 Left 7 ;2:1 MUX
TEXT 1824 528 Left 7 ;4:1 MUX
TEXT 912 3360 Left 7 ;8:1 MUX
RECTANGLE Normal -284 -592 500 396 1
RECTANGLE Normal 2868 400 1280 -752 2
RECTANGLE Normal 1964 3236 244 664 2

The netlist it stands for:
* Digital MUX .asc
V3 Vdd 0 5
V4 s 0 PWL(0 0 2 0 2.005 5 4 5)
V5 b1 0 0
V6 a1 0 0
M3 N001 a1 Vdd Vdd PMOS
M4 N001 _s Vdd Vdd PMOS
M5 N001 a1 N003 N003 NMOS
M6 N003 _s 0 0 NMOS
M19 N002 b1 Vdd Vdd PMOS
M20 N002 s Vdd Vdd PMOS
M21 N002 b1 N005 N005 NMOS
M22 N005 s 0 0 NMOS
M23 21out N001 Vdd Vdd PMOS
M24 21out N002 Vdd Vdd PMOS
M25 21out N001 N004 N004 NMOS
M26 N004 N002 0 0 NMOS
M27 _s s 0 0 NMOS
M28 _s s Vdd Vdd PMOS
V2 d 0 5
V7 c 0 0
M17 _s0 s0 0 0 NMOS
M18 _s0 s0 Vdd Vdd PMOS
M1 _s1 s1 0 0 NMOS
M2 _s1 s1 Vdd Vdd PMOS
M7 aout a Vdd Vdd PMOS
M8 aout _s0 Vdd Vdd PMOS
M9 aout a P001 P001 NMOS
M10 P001 _s0 P002 P002 NMOS
M11 P002 _s1 0 0 NMOS
M12 aout _s1 Vdd Vdd PMOS
M13 bout b Vdd Vdd PMOS
M14 bout _s0 Vdd Vdd PMOS
M15 bout b P003 P003 NMOS
M16 P003 _s0 P004 P004 NMOS
M29 P004 s1 0 0 NMOS
M30 bout s1 Vdd Vdd PMOS
M31 cout c Vdd Vdd PMOS
M32 cout s0 Vdd Vdd PMOS
M33 cout c P005 P005 NMOS
M34 P005 s0 P006 P006 NMOS
M35 P006 _s1 0 0 NMOS
M36 cout _s1 Vdd Vdd PMOS
M37 dout d Vdd Vdd PMOS
M38 dout s0 Vdd Vdd PMOS
M39 dout d P007 P007 NMOS
M40 P007 s0 P008 P008 NMOS
M41 P008 s1 0 0 NMOS
M42 dout s1 Vdd Vdd PMOS
V9 b 0 0
V10 a 0 PWL(0 0 1 0 1.005 5 2 5)
M43 41out aout Vdd Vdd PMOS
M44 41out cout Vdd Vdd PMOS
M45 41out aout P009 P009 NMOS
M46 P009 bout P010 P010 NMOS
M47 P010 cout P011 P011 NMOS
M48 41out dout Vdd Vdd PMOS
M49 P011 dout 0 0 NMOS
M50 41out bout Vdd Vdd PMOS
V11 s1 0 PWL(0 0 4 0 4.005 5 8 5 8.005 0 12 0 12.005 5 16 5)
V12 or0 0 5
V13 and0 0 0
M51 _s0 s0 0 0 NMOS
M52 _s0 s0 Vdd Vdd PMOS
V14 s2 0 PWL(0 0 2 0 2.005 5 4 5 4.005 0 6 0 6.005 5 8 5 8.005 0 10 0 10.005 5 12 5 12.005 0 14 0 14.005 5 16 5)
M53 _s1 s1 0 0 NMOS
M54 _s1 s1 Vdd Vdd PMOS
V15 sub0 0 0
V16 add0 0 PWL(0 0 1 0 1.005 5 2 5)
V17 s0 0 PWL(0 0 8 0 8.005 5 16 5)
V18 shift0 0 5
V19 inc0 0 0
V20 xor0 0 0
V21 not0 0 PWL(0 0 1 0 1.005 5 2 5)
M87 _s2 s2 0 0 NMOS
M88 _s2 s2 Vdd Vdd PMOS
M55 N006 add0 Vdd Vdd PMOS
M56 N006 _s1 Vdd Vdd PMOS
M57 N006 add0 P012 P012 NMOS
M58 P012 _s0 P013 P013 NMOS
M59 P013 _s1 P014 P014 NMOS
M60 N006 _s2 Vdd Vdd PMOS
M61 P014 _s2 0 0 NMOS
M62 N006 _s0 Vdd Vdd PMOS
M63 N008 sub0 Vdd Vdd PMOS
M64 N008 _s1 Vdd Vdd PMOS
M65 N008 sub0 P015 P015 NMOS
M66 P015 _s0 P016 P016 NMOS
M67 P016 _s1 P017 P017 NMOS
M68 N008 s2 Vdd Vdd PMOS
M69 P017 s2 0 0 NMOS
M70 N008 _s0 Vdd Vdd PMOS
M71 N010 and0 Vdd Vdd PMOS
M72 N010 s1 Vdd Vdd PMOS
M73 N010 and0 P018 P018 NMOS
M74 P018 _s0 P019 P019 NMOS
M75 P019 s1 P020 P020 NMOS
M76 N010 _s2 Vdd Vdd PMOS
M77 P020 _s2 0 0 NMOS
M78 N010 _s0 Vdd Vdd PMOS
M79 N011 or0 Vdd Vdd PMOS
M80 N011 s1 Vdd Vdd PMOS
M81 N011 or0 P021 P021 NMOS
M82 P021 _s0 P022 P022 NMOS
M83 P022 s1 P023 P023 NMOS
M84 N011 s2 Vdd Vdd PMOS
M85 P023 s2 0 0 NMOS
M86 N011 _s0 Vdd Vdd PMOS
M89 N007 not0 Vdd Vdd PMOS
M90 N007 _s1 Vdd Vdd PMOS
M91 N007 not0 P024 P024 NMOS
M92 P024 s0 P025 P025 NMOS
M93 P025 _s1 P026 P026 NMOS
M94 N007 _s2 Vdd Vdd PMOS
M95 P026 _s2 0 0 NMOS
M96 N007 s0 Vdd Vdd PMOS
M97 N009 xor0 Vdd Vdd PMOS
M98 N009 _s1 Vdd Vdd PMOS
M99 N009 xor0 P027 P027 NMOS
M100 P027 s0 P028 P028 NMOS
M101 P028 _s1 P029 P029 NMOS
M102 N009 s2 Vdd Vdd PMOS
M103 P029 s2 0 0 NMOS
M104 N009 s0 Vdd Vdd PMOS
M105 N013 inc0 Vdd Vdd PMOS
M106 N013 s1 Vdd Vdd PMOS
M107 N013 inc0 P030 P030 NMOS
M108 P030 s0 P031 P031 NMOS
M109 P031 s1 P032 P032 NMOS
M110 N013 _s2 Vdd Vdd PMOS
M111 P032 _s2 0 0 NMOS
M112 N013 s0 Vdd Vdd PMOS
M113 N012 shift0 Vdd Vdd PMOS
M114 N012 s1 Vdd Vdd PMOS
M115 N012 shift0 P033 P033 NMOS
M116 P033 s0 P034 P034 NMOS
M117 P034 s1 P035 P035 NMOS
M118 N012 s2 Vdd Vdd PMOS
M119 P035 s2 0 0 NMOS
M120 N012 s0 Vdd Vdd PMOS
M121 0out N006 Vdd Vdd PMOS
M122 0out N013 Vdd Vdd PMOS
M123 0out N007 P036 P036 NMOS
M124 P036 N006 P037 P037 NMOS
M125 P037 N008 P038 P038 NMOS
M126 0out N010 Vdd Vdd PMOS
M127 P038 N009 P039 P039 NMOS
M128 0out N007 Vdd Vdd PMOS
M129 P039 N013 P040 P040 NMOS
M130 P040 N010 P041 P041 NMOS
M131 P041 N011 P042 P042 NMOS
M132 P042 N012 0 0 NMOS
M133 0out N011 Vdd Vdd PMOS
M134 0out N012 Vdd Vdd PMOS
M135 0out N009 Vdd Vdd PMOS
M136 0out N008 Vdd Vdd PMOS
.model NMOS NMOS
.model PMOS PMOS
.lib standard.mos
.tran 16
* 2:1 MUX
* 4:1 MUX
* 8:1 MUX
.backanno
.end